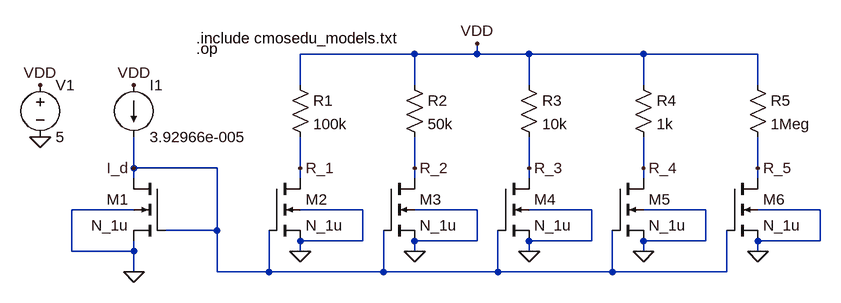
[diagram p0: schematic Parte 6.asc]
Parte 6.asc, the LTspice schematic file:
Version 4
SHEET 1 1236 680
WIRE 576 32 400 32
WIRE 672 32 672 16
WIRE 672 32 576 32
WIRE 752 32 672 32
WIRE 928 32 752 32
WIRE 1104 32 928 32
WIRE 400 80 400 32
WIRE 576 80 576 32
WIRE 752 80 752 32
WIRE 928 80 928 32
WIRE 1104 80 1104 32
WIRE 144 208 144 160
WIRE 272 208 144 208
WIRE 400 208 400 160
WIRE 576 208 576 160
WIRE 752 208 752 160
WIRE 928 208 928 160
WIRE 1104 208 1104 160
WIRE 144 224 144 208
WIRE 400 224 400 208
WIRE 576 224 576 208
WIRE 752 224 752 208
WIRE 928 224 928 208
WIRE 1104 224 1104 208
WIRE 144 272 48 272
WIRE 496 272 400 272
WIRE 672 272 576 272
WIRE 848 272 752 272
WIRE 1024 272 928 272
WIRE 1200 272 1104 272
WIRE 272 304 272 208
WIRE 272 304 192 304
WIRE 496 320 496 272
WIRE 496 320 400 320
WIRE 672 320 672 272
WIRE 672 320 576 320
WIRE 848 320 848 272
WIRE 848 320 752 320
WIRE 1024 320 1024 272
WIRE 1024 320 928 320
WIRE 1200 320 1200 272
WIRE 1200 320 1104 320
WIRE 48 336 48 272
WIRE 144 336 144 320
WIRE 144 336 48 336
WIRE 400 336 400 320
WIRE 576 336 576 320
WIRE 752 336 752 320
WIRE 928 336 928 320
WIRE 1104 336 1104 320
WIRE 144 368 144 336
WIRE 272 368 272 304
WIRE 352 368 352 304
WIRE 352 368 272 368
WIRE 528 368 528 304
WIRE 528 368 352 368
WIRE 704 368 704 304
WIRE 704 368 528 368
WIRE 880 368 880 304
WIRE 880 368 704 368
WIRE 1056 368 1056 304
WIRE 1056 368 880 368
FLAG 144 368 0
FLAG 400 336 0
FLAG 576 336 0
FLAG 752 336 0
FLAG 928 336 0
FLAG 0 160 0
FLAG 672 16 VDD
FLAG 0 80 VDD
FLAG 144 80 VDD
FLAG 1104 336 0
FLAG 400 208 R_1
FLAG 576 208 R_2
FLAG 928 208 R_4
FLAG 1104 208 R_5
FLAG 752 208 R_3
FLAG 144 208 I_d
SYMBOL voltage 0 64 R0
WINDOW 123 0 0 Left 2
WINDOW 39 0 0 Left 2
SYMATTR InstName V1
SYMATTR Value 5
SYMBOL current 144 80 R0
WINDOW 123 0 0 Left 2
WINDOW 39 0 0 Left 2
SYMATTR InstName I1
SYMATTR Value 3.92966e-005
SYMBOL res 384 64 R0
SYMATTR InstName R1
SYMATTR Value 100k
SYMBOL res 560 64 R0
SYMATTR InstName R2
SYMATTR Value 50k
SYMBOL res 736 64 R0
SYMATTR InstName R3
SYMATTR Value 10k
SYMBOL res 912 64 R0
SYMATTR InstName R4
SYMATTR Value 1k
SYMBOL res 1088 64 R0
SYMATTR InstName R5
SYMATTR Value 1Meg
SYMBOL nmos4 192 224 M0
SYMATTR InstName M1
SYMATTR Value N_1u
SYMATTR Value2 l=1.5u w=3u
SYMBOL nmos4 352 224 R0
SYMATTR InstName M2
SYMATTR Value N_1u
SYMATTR Value2 l=1.5u w=3u
SYMBOL nmos4 528 224 R0
SYMATTR InstName M3
SYMATTR Value N_1u
SYMATTR Value2 l=1.5u w=3u
SYMBOL nmos4 704 224 R0
SYMATTR InstName M4
SYMATTR Value N_1u
SYMATTR Value2 l=1.5u w=3u
SYMBOL nmos4 880 224 R0
SYMATTR InstName M5
SYMATTR Value N_1u
SYMATTR Value2 l=1.5u w=3u
SYMBOL nmos4 1056 224 R0
SYMATTR InstName M6
SYMATTR Value N_1u
SYMATTR Value2 l=1.5u w=3u
TEXT 240 24 Left 2 !.op
TEXT 240 8 Left 2 !.include cmosedu_models.txt

The netlist it stands for:
* Parte 6.asc
V1 VDD 0 5
I1 VDD I_d 3.92966e-005
R1 VDD R_1 100k
R2 VDD R_2 50k
R3 VDD R_3 10k
R4 VDD R_4 1k
R5 VDD R_5 1Meg
M1 I_d I_d 0 0 N_1u l=1.5u w=3u
M2 R_1 I_d 0 0 N_1u l=1.5u w=3u
M3 R_2 I_d 0 0 N_1u l=1.5u w=3u
M4 R_3 I_d 0 0 N_1u l=1.5u w=3u
M5 R_4 I_d 0 0 N_1u l=1.5u w=3u
M6 R_5 I_d 0 0 N_1u l=1.5u w=3u
.model NMOS NMOS
.model PMOS PMOS
.lib standard.mos
.op
.include cmosedu_models.txt
.backanno
.end

* Results of the author's LTspice run, read from the files saved beside the schematic
* Operating Point:
*   V(vdd) = 5 V
*   V(i_d) = 1.5 V
*   V(r_1) = 1.11 V
*   V(r_2) = 2.979 V
*   V(r_3) = 4.587 V
*   V(r_4) = 4.958 V
*   V(r_5) = 29.9 mV
*   Id(M6) = 4.97 µA
*   Ig(M6) = 0 A
*   Ib(M6) = -36.75 fA
*   Is(M6) = -4.97 µA
*   Id(M5) = 41.54 µA
*   Ig(M5) = 0 A
*   Ib(M5) = -4.968 pA
*   Is(M5) = -41.54 µA
*   Id(M4) = 41.35 µA
*   Ig(M4) = 0 A
*   Ib(M4) = -4.597 pA
*   Is(M4) = -41.35 µA
*   Id(M3) = 40.42 µA
*   Ig(M3) = 0 A
*   Ib(M3) = -2.989 pA
*   Is(M3) = -40.42 µA
*   Id(M2) = 38.9 µA
*   Ig(M2) = 0 A
*   Ib(M2) = -1.12 pA
*   Is(M2) = -38.9 µA
*   Id(M1) = 39.3 µA
*   Ig(M1) = 0 A
*   Ib(M1) = -1.51 pA
*   Is(M1) = -39.3 µA
*   I(I1) = 39.3 µA
*   I(R5) = 4.97 µA
*   I(R4) = 41.54 µA
*   I(R3) = 41.35 µA
*   I(R2) = 40.42 µA
*   I(R1) = 38.9 µA
*   I(V1) = -206.5 µA
* From the log:
*   Semiconductor Device Operating Points:
*                           --- MOSFET Transistors ---
*   Name:          m6          m5          m4          m3          m2
*   Model:        n_1u        n_1u        n_1u        n_1u        n_1u
*   Id:          4.97e-06    4.15e-05    4.13e-05    4.04e-05    3.89e-05
*   Vgs:         1.50e+00    1.50e+00    1.50e+00    1.50e+00    1.50e+00
*   Vds:         2.99e-02    4.96e+00    4.59e+00    2.98e+00    1.11e+00
*   Vbs:         0.00e+00    0.00e+00    0.00e+00    0.00e+00    0.00e+00
*   Vth:         8.90e-01    8.90e-01    8.90e-01    8.90e-01    8.90e-01
*   Vdsat:       4.74e-01    4.74e-01    4.74e-01    4.74e-01    4.74e-01
*   Gm:          7.19e-06    1.08e-04    1.07e-04    1.05e-04    1.00e-04
*   Gds:         1.59e-04    4.05e-06    4.05e-06    4.09e-06    4.45e-06
*   Gmb:         2.69e-06    3.66e-05    3.64e-05    3.55e-05    3.41e-05
*   Cbd:         0.00e+00    0.00e+00    0.00e+00    0.00e+00    0.00e+00
*   Cbs:         0.00e+00    0.00e+00    0.00e+00    0.00e+00    0.00e+00
*   Cgsov:       6.00e-16    6.00e-16    6.00e-16    6.00e-16    6.00e-16
*   Cgdov:       6.00e-16    6.00e-16    6.00e-16    6.00e-16    6.00e-16
*   Cgbov:       1.30e-16    1.30e-16    1.30e-16    1.30e-16    1.30e-16
*   Cgs:         3.44e-15    4.49e-15    4.49e-15    4.49e-15    4.49e-15
*   Cgd:         3.29e-15    0.00e+00    0.00e+00    0.00e+00    0.00e+00
*   Cgb:         0.00e+00    0.00e+00    0.00e+00    0.00e+00    0.00e+00
*   Name:          m1
*   Model:        n_1u
*   Id:          3.93e-05
*   Vgs:         1.50e+00
*   Vds:         1.50e+00
*   Vbs:         0.00e+00
*   Vth:         8.90e-01
*   Vdsat:       4.74e-01
*   Gm:          1.01e-04
*   Gds:         4.28e-06
*   Gmb:         3.45e-05
*   Cbd:         0.00e+00
*   Cbs:         0.00e+00
*   Cgsov:       6.00e-16
*   Cgdov:       6.00e-16
*   Cgbov:       1.30e-16
*   Cgs:         4.49e-15
*   Cgd:         0.00e+00
*   Cgb:         0.00e+00